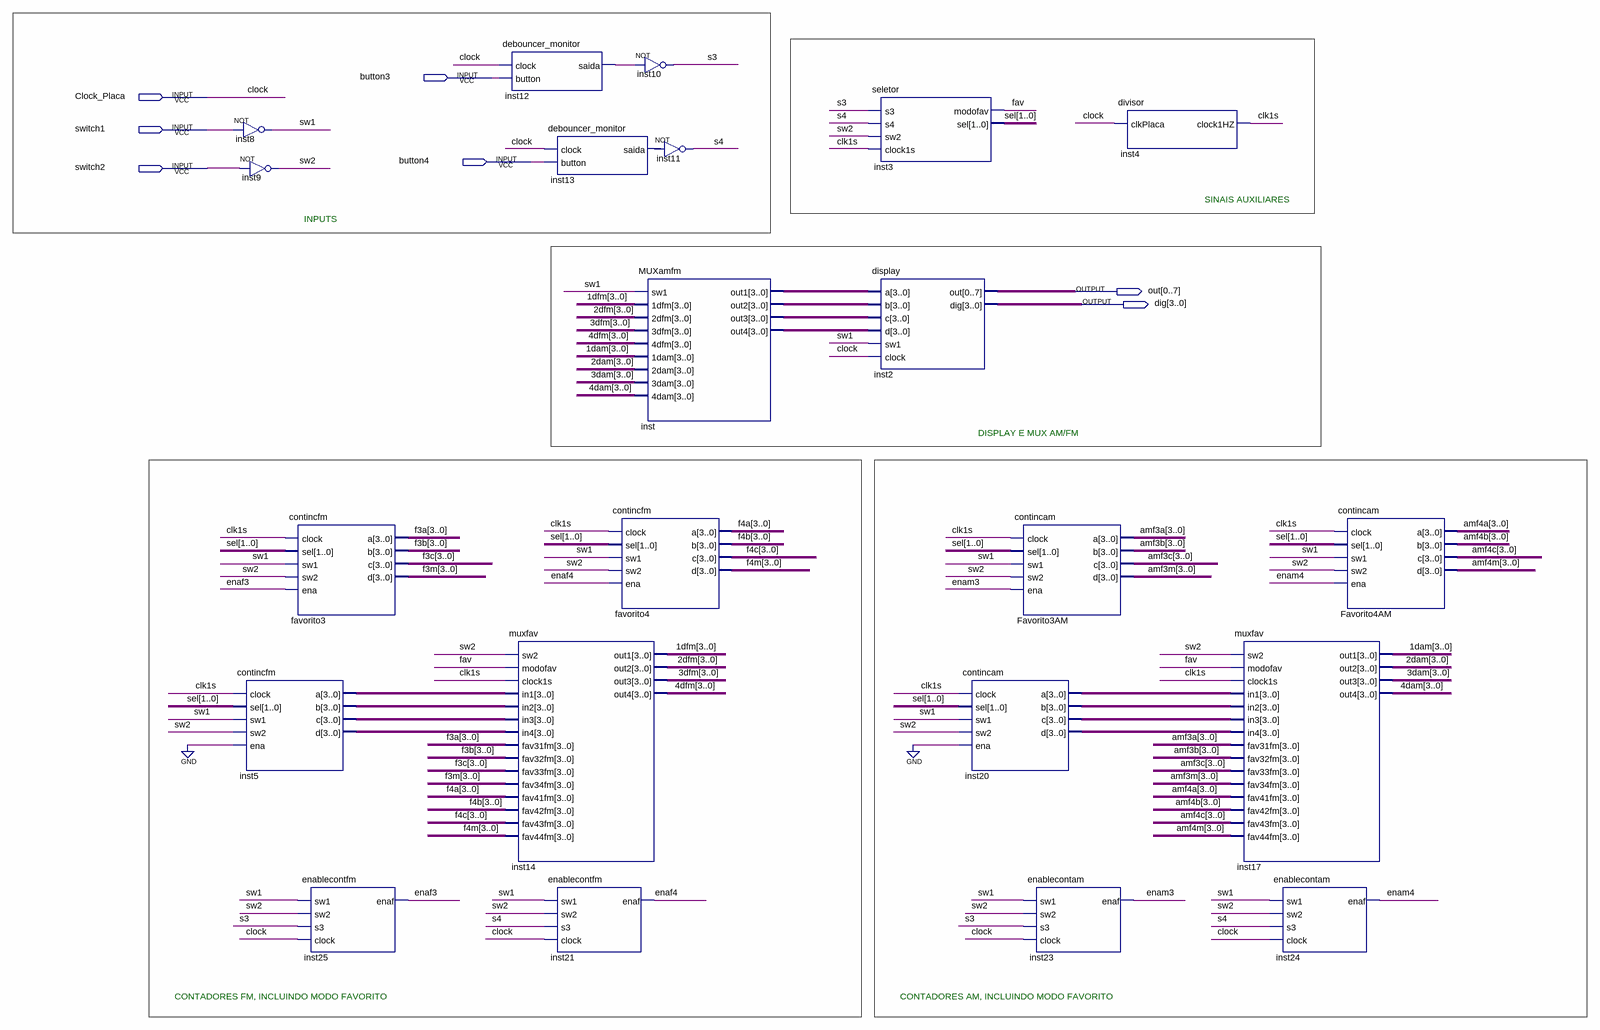
[diagram p0: schematic sheet]
// Quartus schematic blocoproj.bdf as structural Verilog: 22 symbols, 7 pins
module blocoproj (
  input  button3,
  input  Clock_Placa,
  input  switch1,
  input  button4,
  input  switch2,
  output [0:7] out,
  output [3:0] dig
);

  wire clk1s, enaf3, enaf4, enam3, enam4, fav, inst12_saida, inst13_saida, s3, s4, sw1, sw2;
  wire [1:0] sel;
  wire [3:0] \1dam , \1dfm , \2dam , \2dfm , \3dam , \3dfm , \4dam , \4dfm , amf3a, amf3b, amf3c, amf3m,
       amf4a, amf4b, amf4c, amf4m, f3a, f3b, f3c, f3m, f4a, f4b, f4c, f4m, inst5_a, inst5_b, inst5_c,
       inst5_d, inst20_a, inst20_b, inst20_c, inst20_d, inst_out1, inst_out2, inst_out3, inst_out4;

  not inst8 (sw1, switch1);
  not inst9 (sw2, switch2);
  contincfm inst5 (
    .clock(clk1s), .sel(sel), .sw1(sw1), .sw2(sw2), .ena(1'b0), .a(inst5_a), .b(inst5_b), .c(inst5_c),
    .d(inst5_d));
  contincfm favorito3 (.clock(clk1s), .sel(sel), .sw1(sw1), .sw2(sw2), .ena(enaf3), .a(f3a), .b(f3b), .c(f3c), .d(f3m));
  enablecontfm inst25 (.sw1(sw1), .sw2(sw2), .s3(s3), .clock(Clock_Placa), .enaf(enaf3));
  debouncer_monitor inst12 (.clock(Clock_Placa), .button(button3), .saida(inst12_saida));
  muxfav inst14 (
    .sw2(sw2), .modofav(fav), .clock1s(clk1s), .in1(inst5_a), .in2(inst5_b), .in3(inst5_c), .in4(inst5_d),
    .fav31fm(f3a), .fav32fm(f3b), .fav33fm(f3c), .fav34fm(f3m), .fav41fm(f4a), .fav42fm(f4b), .fav43fm(f4c),
    .fav44fm(f4m), .out1(\1dfm ), .out2(\2dfm ), .out3(\3dfm ), .out4(\4dfm ));
  debouncer_monitor inst13 (.clock(Clock_Placa), .button(button4), .saida(inst13_saida));
  enablecontfm inst21 (.sw1(sw1), .sw2(sw2), .s3(s4), .clock(Clock_Placa), .enaf(enaf4));
  not inst10 (s3, inst12_saida);
  MUXamfm inst (
    .sw1(sw1), .\1dfm (\1dfm ), .\2dfm (\2dfm ), .\3dfm (\3dfm ), .\4dfm (\4dfm ), .\1dam (\1dam ),
    .\2dam (\2dam ), .\3dam (\3dam ), .\4dam (\4dam ), .out1(inst_out1), .out2(inst_out2), .out3(inst_out3),
    .out4(inst_out4));
  contincfm favorito4 (.clock(clk1s), .sel(sel), .sw1(sw1), .sw2(sw2), .ena(enaf4), .a(f4a), .b(f4b), .c(f4c), .d(f4m));
  not inst11 (s4, inst13_saida);
  seletor inst3 (.s3(s3), .s4(s4), .sw2(sw2), .clock1s(clk1s), .modofav(fav), .sel(sel));
  display inst2 (
    .a(inst_out1), .b(inst_out2), .c(inst_out3), .d(inst_out4), .sw1(sw1), .clock(Clock_Placa), .out(out),
    .dig(dig));
  contincam inst20 (
    .clock(clk1s), .sel(sel), .sw1(sw1), .sw2(sw2), .ena(1'b0), .a(inst20_a), .b(inst20_b), .c(inst20_c),
    .d(inst20_d));
  contincam Favorito3AM (
    .clock(clk1s), .sel(sel), .sw1(sw1), .sw2(sw2), .ena(enam3), .a(amf3a), .b(amf3b), .c(amf3c), .d(amf3m));
  enablecontam inst23 (.sw1(sw1), .sw2(sw2), .s3(s3), .clock(Clock_Placa), .enaf(enam3));
  divisor inst4 (.clkPlaca(Clock_Placa), .clock1HZ(clk1s));
  muxfav inst17 (
    .sw2(sw2), .modofav(fav), .clock1s(clk1s), .in1(inst20_a), .in2(inst20_b), .in3(inst20_c),
    .in4(inst20_d), .fav31fm(amf3a), .fav32fm(amf3b), .fav33fm(amf3c), .fav34fm(amf3m), .fav41fm(amf4a),
    .fav42fm(amf4b), .fav43fm(amf4c), .fav44fm(amf4m), .out1(\1dam ), .out2(\2dam ), .out3(\3dam ),
    .out4(\4dam ));
  enablecontam inst24 (.sw1(sw1), .sw2(sw2), .s3(s4), .clock(Clock_Placa), .enaf(enam4));
  contincam Favorito4AM (
    .clock(clk1s), .sel(sel), .sw1(sw1), .sw2(sw2), .ena(enam4), .a(amf4a), .b(amf4b), .c(amf4c), .d(amf4m));

  // Other names for the same wires on the sheet: clock = Clock_Placa

  // Notes on the sheet:
  //   SINAIS AUXILIARES
  //   INPUTS
  //   DISPLAY E MUX AM/FM
  //   CONTADORES FM, INCLUINDO MODO FAVORITO
  //   CONTADORES AM, INCLUINDO MODO FAVORITO
endmodule
